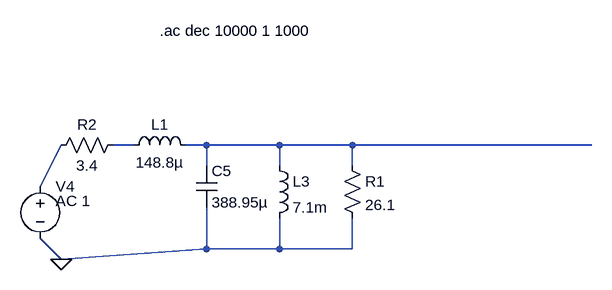
[diagram p0: schematic test.asc]
test.asc, the LTspice schematic file:
Version 4
SHEET 1 1108 996
WIRE -320 768 -352 768
WIRE -208 768 -240 768
WIRE -96 768 -208 768
WIRE 16 768 -96 768
WIRE 384 768 16 768
WIRE -208 800 -208 768
WIRE -96 800 -96 768
WIRE 16 800 16 768
WIRE -464 832 -432 768
WIRE -208 928 -208 864
WIRE -96 928 -96 880
WIRE -96 928 -208 928
WIRE 16 928 16 880
WIRE 16 928 -96 928
WIRE -432 944 -464 912
WIRE -432 944 -208 928
FLAG -432 944 0
SYMBOL cap -224 800 R0
SYMATTR InstName C5
SYMATTR Value 388.95µ
SYMBOL ind -112 784 R0
SYMATTR InstName L3
SYMATTR Value 7.1m
SYMBOL res 0 784 R0
SYMATTR InstName R1
SYMATTR Value 26.1
SYMBOL res -336 752 R90
WINDOW 0 0 56 VBottom 2
WINDOW 3 32 56 VTop 2
SYMATTR InstName R2
SYMATTR Value 3.4
SYMBOL voltage -464 816 R0
WINDOW 123 24 38 Left 2
WINDOW 39 0 0 Left 0
SYMATTR Value2 AC 1
SYMATTR InstName V4
SYMATTR Value ""
SYMBOL ind -336 784 R270
WINDOW 0 32 56 VTop 2
WINDOW 3 5 56 VBottom 2
SYMATTR InstName L1
SYMATTR Value 148.8µ
TEXT -280 592 Left 2 !.ac dec 10000 1 1000

The netlist it stands for:
* test.asc
C5 N002 0 388.95µ
L3 N002 0 7.1m
R1 N002 0 26.1
R2 N001 N003 3.4
V4 N003 0 AC 1
L1 N001 N002 148.8µ
.ac dec 10000 1 1000
.backanno
.end